# Altium project UMParachuteContr.PrjPCB
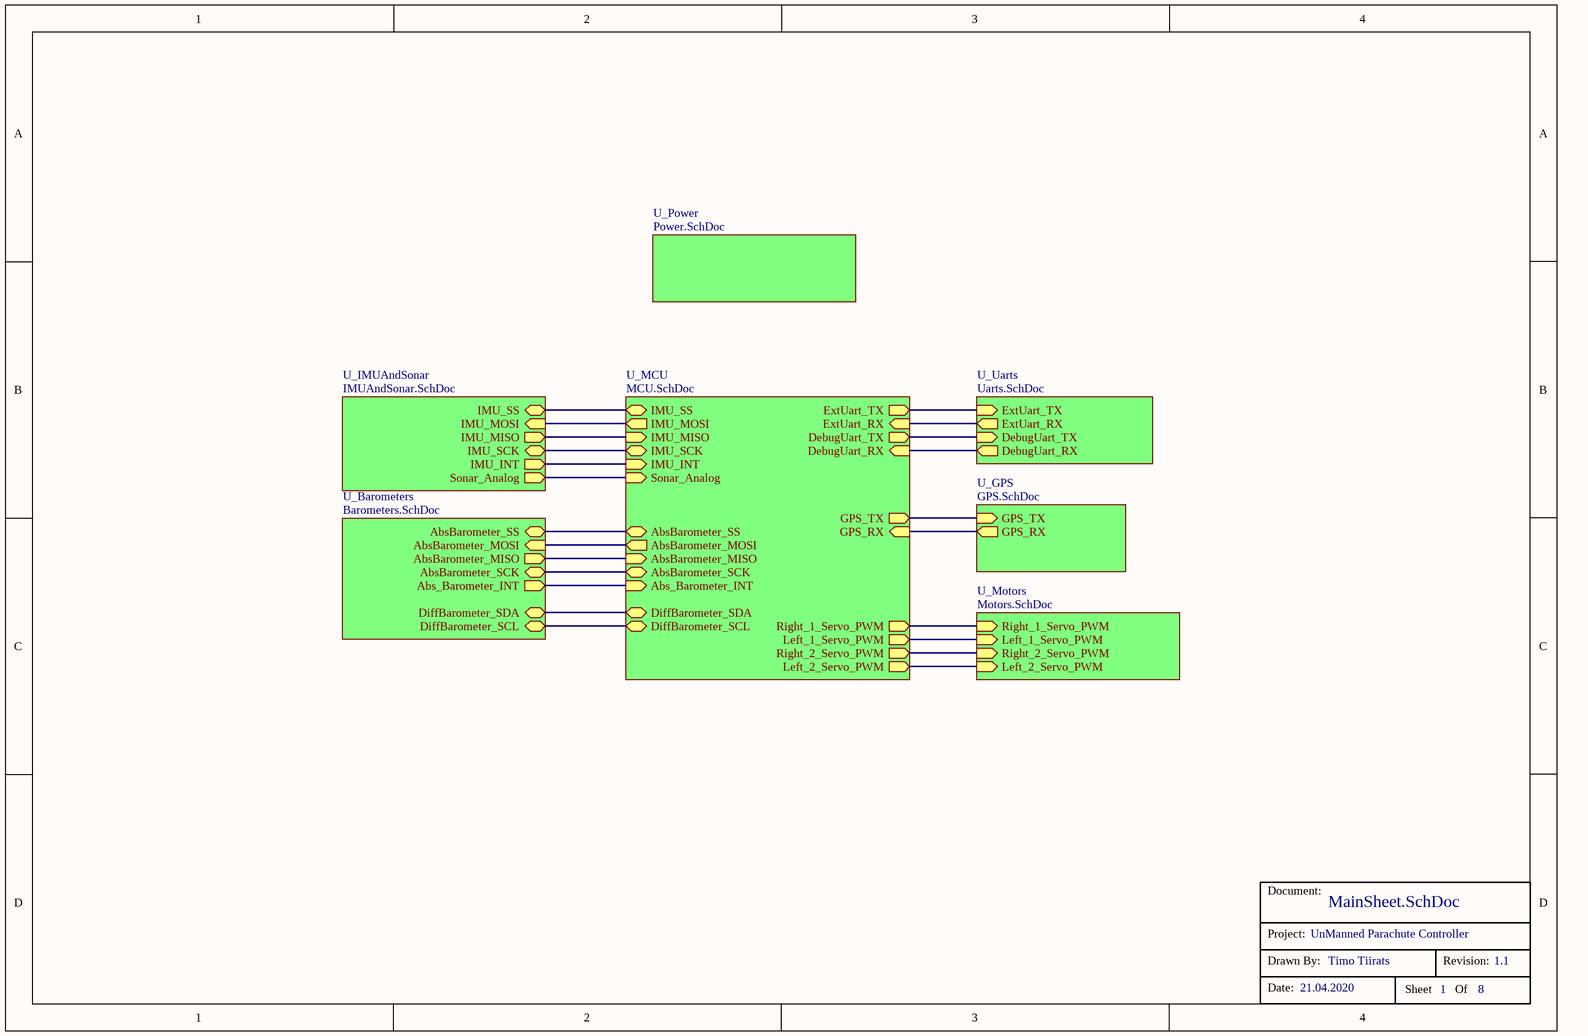
[diagram p0: MainSheet.SchDoc]
RevisionNr: 1.1; Project: UnManned Parachute Controller; Drawn: Timo Tiirats; SaveDate: 21.04.2020
8 sheets, 139 parts. Net scope: hierarchical (ports join the sheet entries above them; power ports are global).
Board file: UMParachuteContr.PcbDoc
Sheets:
  MainSheet.SchDoc
    U_Power = Power.SchDoc
    U_Uarts = Uarts.SchDoc
    U_GPS = GPS.SchDoc
    U_IMUAndSonar = IMUAndSonar.SchDoc
    U_MCU = MCU.SchDoc
    U_Motors = Motors.SchDoc
    U_Barometers = Barometers.SchDoc

## Sheet MainSheet.SchDoc
size A4; SheetNumber: 1; SheetTotal: 8

### Parts
(Parts that share a designator on the sheet are numbered #1, #2 ... from top to bottom, then left to right.)
*#1  TitleBox  (value not drawn)

### Sub-sheets
U_Barometers = Barometers.SchDoc: AbsBarometer_SCK (bidir), AbsBarometer_MOSI (in), AbsBarometer_MISO (out), AbsBarometer_SS (bidir), DiffBarometer_SCL (bidir), DiffBarometer_SDA (bidir), Abs_Barometer_INT (out)
U_GPS = GPS.SchDoc: GPS_TX (in), GPS_RX (out)
U_IMUAndSonar = IMUAndSonar.SchDoc: IMU_SCK (bidir), IMU_MOSI (in), IMU_MISO (out), IMU_SS (bidir), Sonar_Analog (out), IMU_INT (out)
U_MCU = MCU.SchDoc: ExtUart_RX (in), ExtUart_TX (out), IMU_SS (bidir), IMU_MOSI (out), IMU_MISO (in), IMU_SCK (bidir), GPS_RX (in), GPS_TX (out), DiffBarometer_SDA (bidir), DiffBarometer_SCL (bidir), AbsBarometer_SS (bidir), AbsBarometer_MOSI (out), AbsBarometer_MISO (in), AbsBarometer_SCK (bidir), DebugUart_RX (in), DebugUart_TX (out), Sonar_Analog (in), Right_1_Servo_PWM (out), Left_1_Servo_PWM (out), Right_2_Servo_PWM (out), Left_2_Servo_PWM (out), Abs_Barometer_INT (in), IMU_INT (in)
U_Motors = Motors.SchDoc: Right_1_Servo_PWM (in), Left_1_Servo_PWM (in), Right_2_Servo_PWM (in), Left_2_Servo_PWM (in)
U_Power = Power.SchDoc: no entries
U_Uarts = Uarts.SchDoc: DebugUart_RX (out), DebugUart_TX (in), ExtUart_RX (out), ExtUart_TX (in)

### Nets
NetC22_2: sheet U_IMUAndSonar/Sonar_Analog, sheet U_MCU/Sonar_Analog
NetIC2_2: sheet U_MCU/AbsBarometer_SCK, sheet U_Barometers/AbsBarometer_SCK
NetIC2_4: sheet U_MCU/AbsBarometer_MOSI, sheet U_Barometers/AbsBarometer_MOSI
NetIC2_5: sheet U_MCU/AbsBarometer_MISO, sheet U_Barometers/AbsBarometer_MISO
NetIC2_6: sheet U_MCU/AbsBarometer_SS, sheet U_Barometers/AbsBarometer_SS
NetIC2_7: sheet U_MCU/Abs_Barometer_INT, sheet U_Barometers/Abs_Barometer_INT
NetIC3_10: sheet U_MCU/DiffBarometer_SDA, sheet U_Barometers/DiffBarometer_SDA
NetIC3_11: sheet U_MCU/DiffBarometer_SCL, sheet U_Barometers/DiffBarometer_SCL
NetIC4_3: sheet U_MCU/Left_1_Servo_PWM, sheet U_Motors/Left_1_Servo_PWM
NetIC4_4: sheet U_MCU/Right_2_Servo_PWM, sheet U_Motors/Right_2_Servo_PWM
NetIC4_5: sheet U_MCU/Left_2_Servo_PWM, sheet U_Motors/Left_2_Servo_PWM
NetIC4_6: sheet U_MCU/Right_1_Servo_PWM, sheet U_Motors/Right_1_Servo_PWM
NetIC5_11: sheet U_IMUAndSonar/IMU_INT, sheet U_MCU/IMU_INT
NetIC5_12: sheet U_IMUAndSonar/IMU_SCK, sheet U_MCU/IMU_SCK
NetIC5_13: sheet U_IMUAndSonar/IMU_MISO, sheet U_MCU/IMU_MISO
NetIC5_14: sheet U_IMUAndSonar/IMU_MOSI, sheet U_MCU/IMU_MOSI
NetIC5_16: sheet U_IMUAndSonar/IMU_SS, sheet U_MCU/IMU_SS
NetR1_2: sheet U_Uarts/DebugUart_RX, sheet U_MCU/DebugUart_RX
NetR2_2: sheet U_Uarts/DebugUart_TX, sheet U_MCU/DebugUart_TX
NetR3_2: sheet U_Uarts/ExtUart_RX, sheet U_MCU/ExtUart_RX
NetR4_2: sheet U_Uarts/ExtUart_TX, sheet U_MCU/ExtUart_TX
NetR18_2: sheet U_GPS/GPS_TX, sheet U_MCU/GPS_TX
NetR19_2: sheet U_GPS/GPS_RX, sheet U_MCU/GPS_RX

### Notes on the sheet
- Title
- Size:
- Date:
- A4
- Number:
- Time:
- Revision:
- Sheet
- of
- File:
- (in symbol TitleBox) Document:; Project:; Drawn By:; Revision:; Date:; Sheet; Of

## Sheet Power.SchDoc
size A4; SheetNumber: 2; SheetTotal: 8
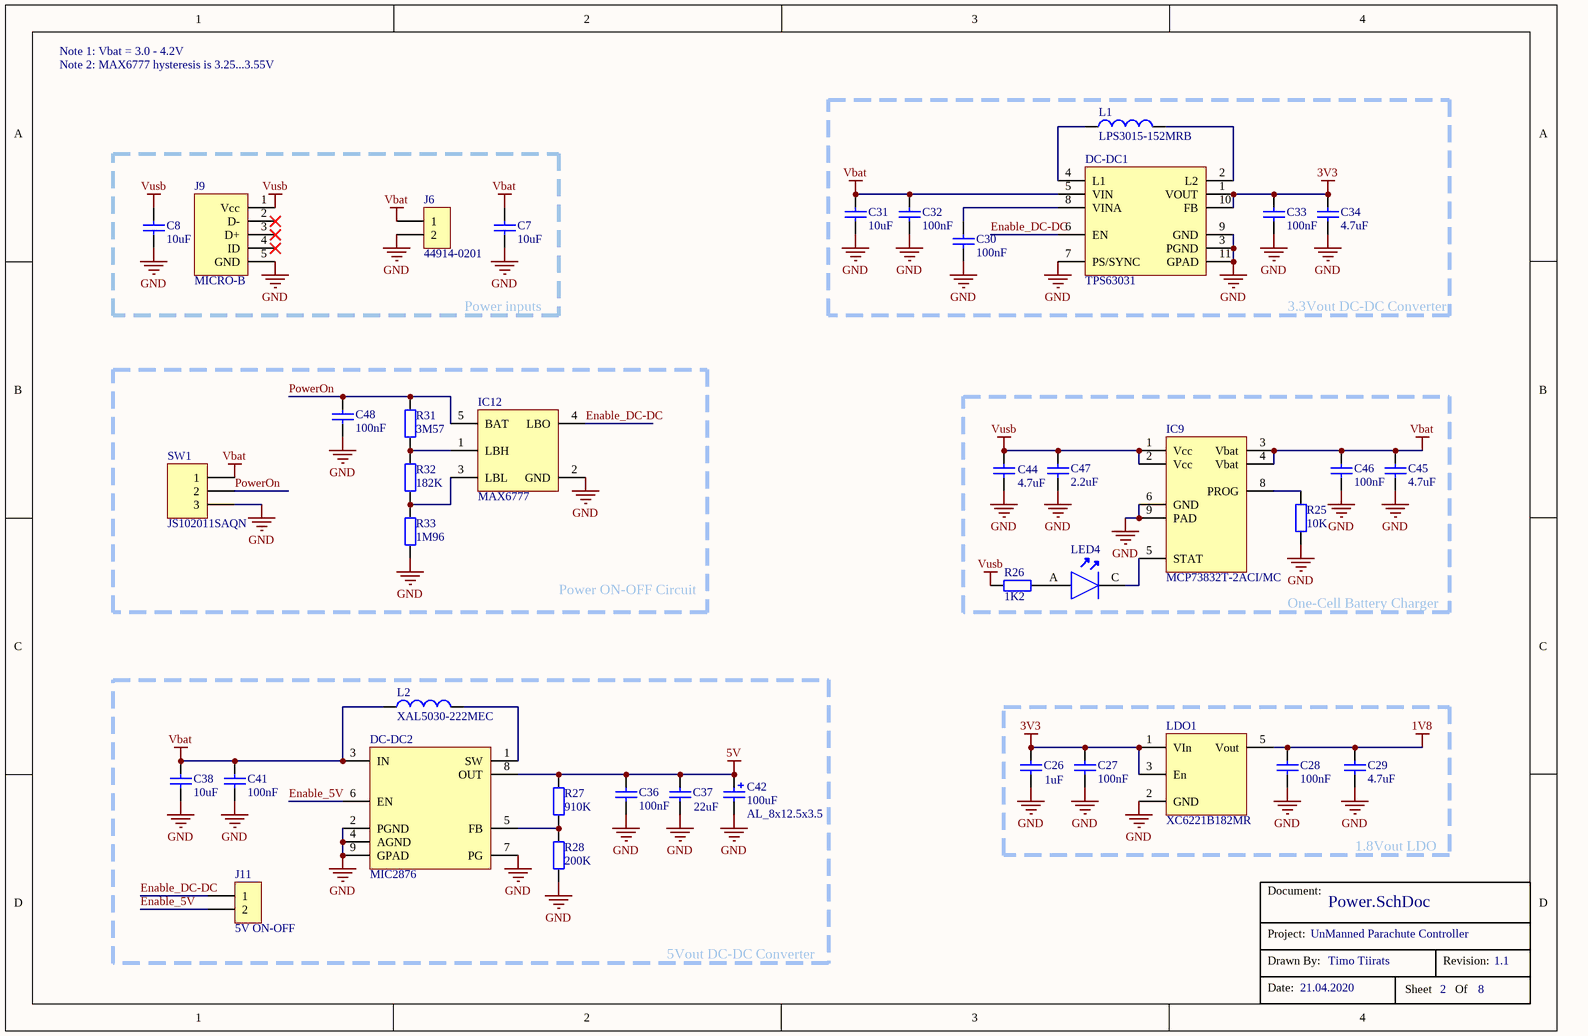
[diagram p1: Power.SchDoc]

### Parts
(Parts that share a designator on the sheet are numbered #1, #2 ... from top to bottom, then left to right.)
*#2  TitleBox  (value not drawn)
C7  Capacitance: 10uF  [C1206 N]
C8  Capacitance: 10uF  [C1206 N]
C26  Capacitance: 1uF  [C0603 N]
C27  Capacitance: 100nF  [C0603 N]
C28  Capacitance: 100nF  [C0603 N]
C29  Capacitance: 4.7uF  [C0603 N]
C30  Capacitance: 100nF  [C0603 N]
C31  Capacitance: 10uF  [C1206 N]
C32  Capacitance: 100nF  [C0603 N]
C33  Capacitance: 100nF  [C0603 N]
C34  Capacitance: 4.7uF  [C0603 N]
C36  Capacitance: 100nF  [C0603 N]
C37  Capacitance: 22uF  [C1206 N]
C38  Capacitance: 10uF  [C1206 N]
C41  Capacitance: 100nF  [C0603 N]
C42  Capacitance: 100uF  [AL_8x12.5x3.5]
C44  Capacitance: 4.7uF  [C1206 N]
C45  Capacitance: 4.7uF  [C1206 N]
C46  Capacitance: 100nF  [C0603 N]
C47  Capacitance: 2.2uF  [C0603 N]
C48  Capacitance: 100nF  [C0603 N]
DC-DC1  TPS63031  [WSON10, 2.6x2.6, LEAST]
DC-DC2  MIC2876  [QFN-8 2x2MM, NOMINAL]
IC9  MCP73832T-2ACI/MC  [DFN-8, 2X3MM]
IC12  MAX6777  [SOT323-5, Nominal]
J6  44914-0201  [44914-0201]
J9  MICRO-B  [MICRO-B]
J11  5V ON-OFF  [Male 1x2 vertical]
L1  LPS3015-152MRB  [LPS3010]
L2  XAL5030-222MEC  [XAL5030-222MEC]
LDO1  XC6221B182MR  [SOT-23-5, Nominal]
LED4  DebugLED1  [0603 NOMINAL]  (value not drawn)
R25  10K  [R0603]
R26  1K2  [R0603]
R27  910K  [R0603]
R28  200K  [R0603]
R31  3M57  [R0603]
R32  182K  [R0603]
R33  1M96  [R0603]
SW1  JS102011SAQN  [JS102011SAQN]

### Blocks framed on the sheet
3.3Vout DC-DC Converter: C30-C34 DC-DC1 L1
Power inputs: C7 C8 J6 J9
Power ON-OFF Circuit: C48 IC12 R31-R33 SW1
One-Cell Battery Charger: C44-C47 IC9 LED4 R25 R26
5Vout DC-DC Converter: C36-C38 C41 C42 DC-DC2 J11 L2 R27 R28
1.8Vout LDO: C26-C29 LDO1

### Nets
1V8: C28.2 C29.2 LDO1.5(Vout)
3V3: C26.2 C27.2 C33.2 C34.2 DC-DC1.1(VOUT) DC-DC1.10(FB) LDO1.1(VIn) LDO1.3(En)
5V: C36.2 C37.2 C42.1 DC-DC2.8(OUT) R27.2
GND: C7.1 C8.1 C26.1 C27.1 C28.1 C29.1 C30.1 C31.1 C32.1 C33.1 C34.1 C36.1 C37.1 C38.1 C41.1 C42.2 C44.1 C45.1 C46.1 C47.1 C48.1 DC-DC1.3(PGND) DC-DC1.7(PS/SYNC) DC-DC1.9(GND) DC-DC1.11(GPAD) DC-DC2.2(PGND) DC-DC2.4(AGND) DC-DC2.7(PG) DC-DC2.9(GPAD) IC9.6(GND) IC9.9(PAD) IC12.2(GND) J6.2 J9.5(GND) LDO1.2(GND) R25.2 R28.1 R33.2 SW1.3
Vbat: C7.2 C31.2 C32.2 C38.2 C41.2 C45.2 C46.2 DC-DC1.5(VIN) DC-DC2.3(IN) IC9.3(Vbat) IC9.4(Vbat) J6.1 L2.1 SW1.1
Vusb: C8.2 C44.2 C47.2 IC9.1(Vcc) IC9.2(Vcc) J9.1(Vcc) R26.1
Enable_5V: DC-DC2.6(EN) J11.2
Enable_DC-DC: DC-DC1.6(EN) IC12.4(LBO) J11.1
PowerOn: C48.2 IC12.5(BAT) R31.1 SW1.2
NetC30_2: C30.2 DC-DC1.8(VINA)
NetDC-DC1_2: DC-DC1.2(L2) L1.2
NetDC-DC1_4: DC-DC1.4(L1) L1.1
NetDC-DC2_1: DC-DC2.1(SW) L2.2
NetDC-DC2_5: DC-DC2.5(FB) R27.1 R28.2
NetIC9_5: IC9.5(STAT) LED4.C
NetIC9_8: IC9.8(PROG) R25.1
NetIC12_1: IC12.1(LBH) R31.2 R32.1
NetIC12_3: IC12.3(LBL) R32.2 R33.1
NetLED4_A: LED4.A R26.2

Not connected (* = marked no-connect by the designer): J9 2(D-)* 3(D+)* 4(ID)*

### Notes on the sheet
- Note 1: Vbat = 3.0 - 4.2V
- Note 2: MAX6777 hysteresis is 3.25...3.55V
- (in symbol TitleBox) Document:; Project:; Drawn By:; Revision:; Date:; Sheet; Of

### Library data of the parts
C7 C8 C26-C34 C36-C38 C41 C44-C48 = Capacitor: Ceramic capacitor; Type: MLCC; Voltage rating: *V; Characteristic: *; Manufacturer: *
  C7 C8 C31 C37 C38 C44 C45: Note: C1206 N
  C26-C30 C32-C34 C36 C41 C46-C48: Note: C0603 N
C42 = Capacitor Polarized: Polarized Capacitor; Voltage rating: *V; ESR: *R; Temp MAX: *C; Temp MIN: *C; Manufacturer: *; Note: AL_8x12.5x3.5
DC-DC1 = TPS63031: DC-DC CONVERTER, 3.3Vout, 1.8...5.5Vin, buck-boost, 800mA, TPS63031, TEXAS INSTRUMENTS; ComponentLink1Description: Datasheet; ComponentLink1URL: http://www.ti.com/lit/ds/symlink/tps63030.pdf
DC-DC2 = MIC2876: DC-DC CONVERTER, ADJ, Vin...5.5Vout, 2.5...5.5Vin, 4.8A, boost, MIC2875, Microchip; ComponentLink1Description: Datasheet; ComponentLink1URL: http://ww1.microchip.com/downloads/en/DeviceDoc/20005549A.pdf
IC9 = MCP73832T-2ACI: Battery Charger, 1 Cell of Li-Ion, Li-Pol, 3.75...6Vin, 15...500mA, 4.2Vout, DFN-8, MCP73832T-2ACI/MC, MICROCHIP; Output Current: 505mA; Output Voltage: 4.2V; Supply Voltage Range: 3.75 .. 6V; Operating Supply Current: 510uA; Supplier 1: Farnell; Manufacturer: Microchip; Manufacturer Part Number: MCP73832T-2ACI/MC; Operating Temperature Range: -40 .. 85°C; ComponentLink1URL: http://www.microchip.com/mymicrochip/filehandler.aspx?ddocname=en026002&src-supplier=Digi-Key; ComponentLink1Description: Datasheet; Supplier 2: Mouser; Supplier Part Number 1: 2857755RL; Supplier Part Number 2: 579-MCP73832T-2ACIMC
IC12 = MAX6777: Battery monitor, 1 cell, Li-ion, adj hysteresis, 1.0...5.5Vin, MAX6777, Maxim; ComponentLink1Description: Datasheet; ComponentLink1URL: http://www.farnell.com/datasheets/702614.pdf?_ga=2.184496931.465896120.1585759027-1429076973.1585049483
J6 = 44914-0201: MicroFit 2-pin CPI Header, 2 Row, Vertical; Manufacturer: Molex; Number of Positions: 2; Current Rating: 5A; Voltage Rating: 250V; Pitch: 3mm; Glow Wire Compliant: Compliant; Supplier 1: Mouser; Manufacturer Part Number: 44914-0201; Stock 1: 1889; Mount: Through Hole; Contact Plating: Tin; Color: Black; Housing Material: Thermoplastic; Operating Temperature: -40...105°C; Package Quantity: 3168; Number of Rows: 2; Packaging: Tray; Termination: Solder; Number of Contacts: 2; Orientation: Vertical; Voltage Rating (DC): 250V; Number of Circuits: 2; Row Spacing: 3mm; REACH SVHC: No SVHC; Halogen Free: Low Halogen; Flammability Rating: UL94 V-0; ComponentLink1URL: http://www.mouser.com/ds/2/276/0449140201_PCB_HEADERS-146076.pdf?src-supplier=Mouser; ComponentLink1Description: http://www.mouser.com/ds/2/276/0449140201_PCB_HEADERS-146076.pdf?src-supplier=Mouser; ComponentLink2URL: http://www.onlinecomponents.com/productFiles/mf-MOL/0449140201_pcb_headers.pdf?src-supplier=Onlinecomponents.com; ComponentLink2Description: http://www.onlinecomponents.com/productFiles/mf-MOL/0449140201_pcb_headers.pdf?src-supplier=Onlinecomponents.com; Supplier Part Number 1: 538-44914-0201
J9 = MICRO-B: Micro USB 2.0 type B, receptacle; Manufacturer: Molex; Manufacturer Part Number: 47346-1001; Pitch: 0.65mm; Supplier 1: Farnell; Operating Temperature Range: -30 .. 85°C; Orientation: Right Angle; Supplier 2: Mouser; Supplier Part Number 2: 538-47346-1001; Supplier Part Number 1: 2779944; ComponentLink1Description: Datasheet; ComponentLink1URL: http://www.farnell.com/datasheets/2696879.pdf
J11 = header 1x2 vertical
L1 = LPS3015-152MRB: Inductor, 1.5uH, 100mR, 1.3A, LPS3015-152MRB, COILCRAFT; ComponentLink1Description: Datasheet; ComponentLink1URL: http://www.farnell.com/datasheets/1805321.pdf?_ga=2.252438669.562777961.1586113222-1429076973.1585049483
L2 = XAL5030-222MEC: Inductor, 2.2uH, 14mR, 9.2A, Coilcraft, XAL5030-222MEC; ComponentLink1Description: Datasheet; ComponentLink1URL: http://www.farnell.com/datasheets/1681990.pdf?_ga=2.217580054.1886183070.1585497363-1429076973.1585049483
LDO1 = XC6221B182MR: LDO, 1.8Vout, 1.6-6Vin, SOT-25, SMD,  HIGH SPEED LOW NOISE, TOREX - XC6221B182MR; Input Voltage Max: 6V; Fixed Output Voltage Nom.: 1.8V; Dropout Voltage Vdo: 0.125V @ 100mA; Accuracy %: 2%; Output Current Max: 200mA; Supplier 1: Farnell; Manufacturer: TOREX; Manufacturer Part Number: XC6221B182MR; LDO Regulator Case Style: SOT-25; Operating Temperature Range: -40°C to +85; Supplier 2: Digi-Key; Current - Output: 200mA; ComponentLink2URL: http://www.torex.co.jp/english/products/voltage_regulators/data/XC6221.pdf; ComponentLink2Description: Datasheet; Supplier Part Number 1: 1454268; Supplier Part Number 2: 893-1096-6-ND
LED4 = Generic LED: SMD mono-color Chip LED; Color: Green
R25-R28 R31-R33 = Resistor: Precision: *%; Voltage rating: *V; Temp coefficient: *ppm; Power rating: *mW; Manufacturer: *; Note: R0603
  R25: Resistance: 10K
  R26: Resistance: 1K2
  R27: Resistance: 910K
  R28: Resistance: 200K
  R31: Resistance: 3M57
  R32: Resistance: 182K
  R33: Resistance: 1M96
SW1 = JS102011SAQN: Manufacturer: ITT C&K; Max Voltage Rating (DC): 6V; Current Rating: 300mA; Contact Resistance: 70mR; Electrical Life: 5000Cycles; Switch Function: On-On; Supplier 1: Farnell; Manufacturer Part Number: JS102011SAQN; Mount: Surface Mount; Operating Temperature Range: -40 .. 85°C; Voltage Rating (DC): 6V; Contact Current Rating: 300mA; Orientation: Right Angle; ComponentLink1URL: http://www.farnell.com/datasheets/2044601.pdf?src-supplier=Element14; ComponentLink1Description: Datasheet; ComponentLink2URL: http://www1.futureelectronics.com/doc/C%20-%20K%20COMPONENTS/JS102011SAQN.pdf?src-supplier=Future+Electronics; ComponentLink2Description: http://www1.futureelectronics.com/doc/C%20-%20K%20COMPONENTS/JS102011SAQN.pdf?src-supplier=Future+Electronics; ComponentLink3URL: https://www.verical.com/server-webapp/html/getDatasheet?partID=313004&src-supplier=Verical; ComponentLink3Description: https://www.verical.com/server-webapp/html/getDatasheet?partID=313004&src-supplier=Verical; ComponentLink4URL: https://www.ckswitches.com/media/1422/js.pdf?src-supplier=Digi-Key; ComponentLink4Description: https://www.ckswitches.com/media/1422/js.pdf?src-supplier=Digi-Key; ComponentLink5URL: http://www.ck-components.com/14398/js_1nov12.pdf/?src-supplier=Avnet; ComponentLink5Description: http://www.ck-components.com/14398/js_1nov12.pdf/?src-supplier=Avnet; ComponentLink6URL: http://www.ck-components.com/14398/js_1nov12.pdf/?src-supplier=Avnet+Europe; ComponentLink6Description: http://www.ck-components.com/14398/js_1nov12.pdf/?src-supplier=Avnet+Europe; ComponentLink7URL: http://www.mouser.com/ds/2/60/JS_7jan16-221285.pdf?src-supplier=Mouser; ComponentLink7Description: http://www.mouser.com/ds/2/60/JS_7jan16-221285.pdf?src-supplier=Mouser; Supplier Part Number 1: 2320017RL; Supplier Prt Number 1: 2320017

## Sheet Uarts.SchDoc
size A4; SheetNumber: 4; SheetTotal: 8
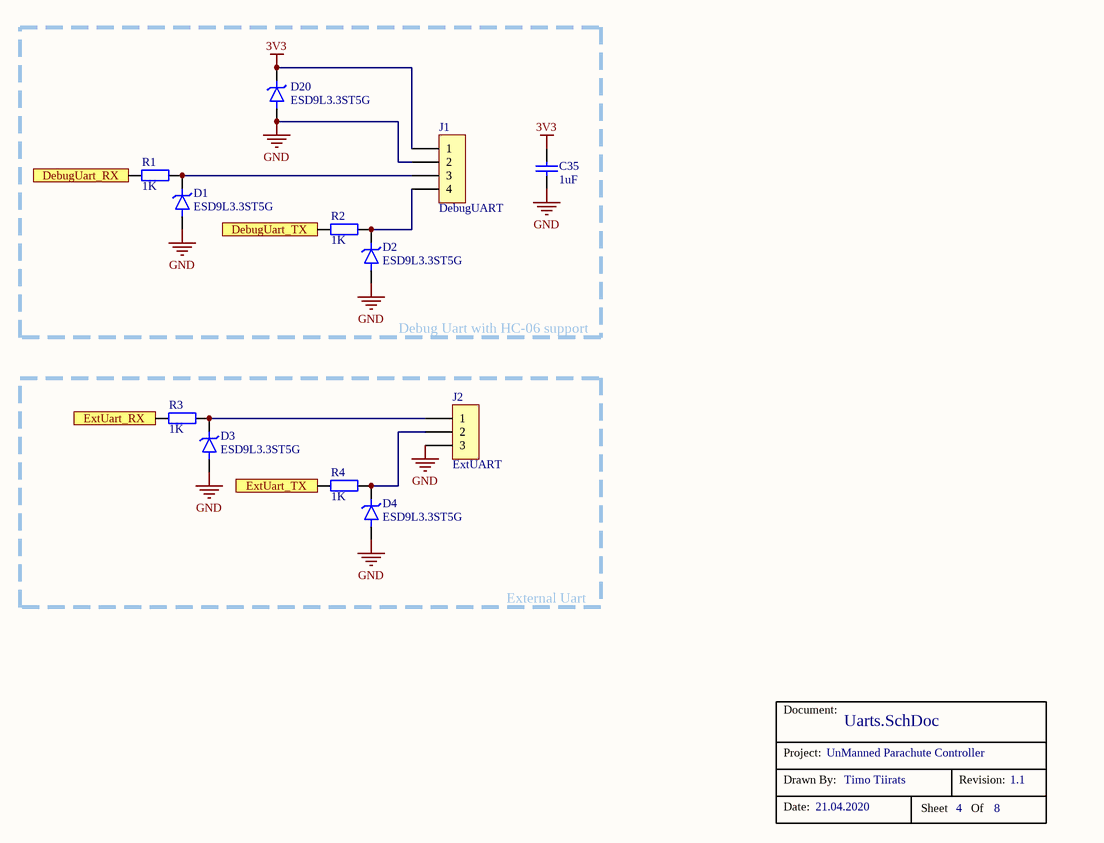
[diagram p2: Uarts.SchDoc]

### Parts
(Parts that share a designator on the sheet are numbered #1, #2 ... from top to bottom, then left to right.)
*#3  TitleBox  (value not drawn)
C35  Capacitance: 1uF  [C0603 N]
D1  ESD9L3.3ST5G  [SOD923F, NOMINAL]
D2  ESD9L3.3ST5G  [SOD923F, NOMINAL]
D3  ESD9L3.3ST5G  [SOD923F, NOMINAL]
D4  ESD9L3.3ST5G  [SOD923F, NOMINAL]
D20  ESD9L3.3ST5G  [SOD923F, NOMINAL]
J1  DebugUART  [female 1x4 vertical]
J2  ExtUART  [UART_HEADER]
R1  1K  [R0603]
R2  1K  [R0603]
R3  1K  [R0603]
R4  1K  [R0603]

### Blocks framed on the sheet
Debug Uart with HC-06 support: C35 D1 D2 D20 J1 R1 R2
External Uart: D3 D4 J2 R3 R4

### Ports
DebugUart_RX (out), DebugUart_TX (in), ExtUart_RX (out), ExtUart_TX (in)

### Nets
3V3: C35.2 D20.C J1.1
GND: C35.1 D1.A D2.A D3.A D4.A D20.A J1.2 J2.3
NetD1_C: D1.C J1.3 R1.1
NetD2_C: D2.C J1.4 R2.1
NetD3_C: D3.C J2.1 R3.1
NetD4_C: D4.C J2.2 R4.1
NetR1_2: R1.2 ; port DebugUart_RX
NetR2_2: R2.2 ; port DebugUart_TX
NetR3_2: R3.2 ; port ExtUart_RX
NetR4_2: R4.2 ; port ExtUart_TX

### Notes on the sheet
- (in symbol TitleBox) Document:; Project:; Drawn By:; Revision:; Date:; Sheet; Of

### Library data of the parts
C35 = Capacitor: as C7 on sheet Power; Characteristic: *; Manufacturer: *; Note: C0603 N
D1-D4 D20 = ESD9L3.3ST5G: TVS DIODE, Unidir, 3.3V/9V, 150mW, SOD-923, ESD9L3.3ST5G, ON SEMICONDUCTOR; Clamping Voltage: 9V; Reverse Standoff Voltage: 3.3V; Breakdown Voltage: 4.8V; Peak Pulse Current: 1A; Leakage Current: 1uA; Supplier 1: Farnell; Manufacturer: ON Semiconductor; Manufacturer Part Number: ESD9L3.3ST5G; Case/Package: SOD-923-2; Operating Temperature Range: -55 .. 125°C; Peak Pulse Power: 150mW; ComponentLink1URL: https://www.verical.com/server-webapp/html/getDatasheet?partID=148186&src-supplier=Verical; ComponentLink1Description: Datasheet; Supplier Part Number 1: 2533269
J1 = header 1x4 vertical
J2 = header 1x3 vertical
R1-R4 = Resistor: as R25 on sheet Power; Manufacturer: *; Resistance: 1K; Note: R0603

## Sheet GPS.SchDoc
size A4; SheetNumber: 6; SheetTotal: 8
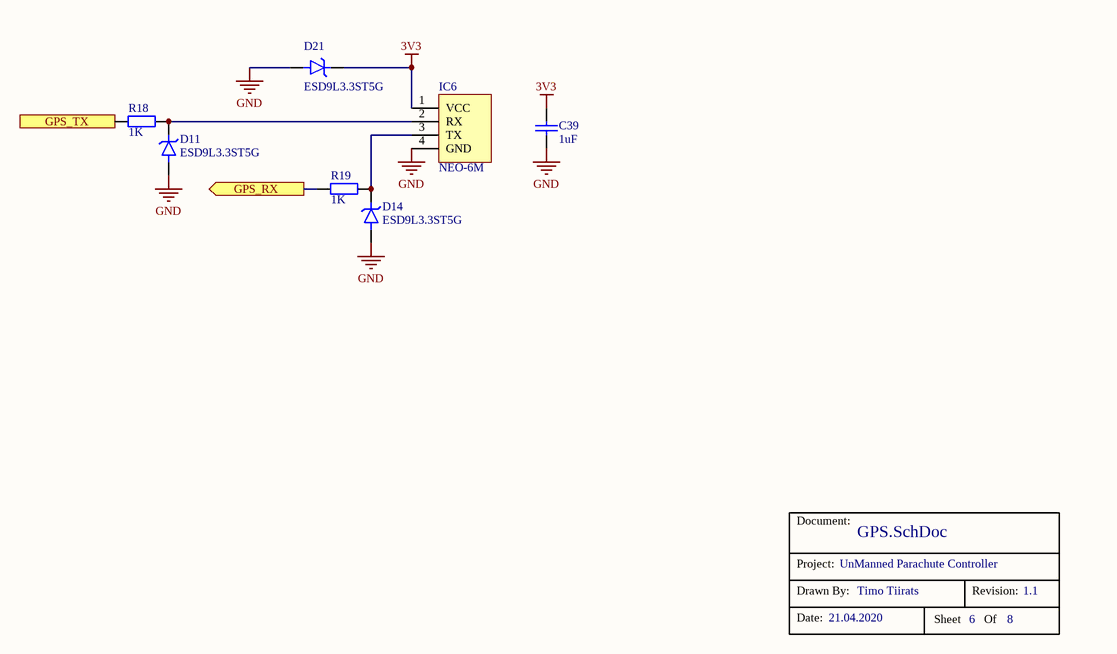
[diagram p3: GPS.SchDoc]

### Parts
(Parts that share a designator on the sheet are numbered #1, #2 ... from top to bottom, then left to right.)
*#4  TitleBox  (value not drawn)
C39  Capacitance: 1uF  [C0603 N]
D11  ESD9L3.3ST5G  [SOD923F, NOMINAL]
D14  ESD9L3.3ST5G  [SOD923F, NOMINAL]
D21  ESD9L3.3ST5G  [SOD923F, NOMINAL]
IC6  NEO-6M  [NEO-6M Module]
R18  1K  [R0603]
R19  1K  [R0603]

### Ports
GPS_RX (out), GPS_TX (in)

### Nets
3V3: C39.2 D21.C IC6.1(VCC)
GND: C39.1 D11.A D14.A D21.A IC6.4(GND)
NetD11_C: D11.C IC6.2(RX) R18.1
NetD14_C: D14.C IC6.3(TX) R19.1
NetR18_2: R18.2 ; port GPS_TX
NetR19_2: R19.2 ; port GPS_RX

### Notes on the sheet
- (in symbol TitleBox) Document:; Project:; Drawn By:; Revision:; Date:; Sheet; Of

### Library data of the parts
C39 = Capacitor: as C7 on sheet Power; Characteristic: *; Manufacturer: *; Note: C0603 N
D11 D14 D21 = ESD9L3.3ST5G: as D1 on sheet Uarts; Supplier 1: Farnell; Manufacturer: ON Semiconductor; Manufacturer Part Number: ESD9L3.3ST5G; Case/Package: SOD-923-2; Operating Temperature Range: -55 .. 125°C; Peak Pulse Power: 150mW; ComponentLink1URL: https://www.verical.com/server-webapp/html/getDatasheet?partID=148186&src-supplier=Verical; ComponentLink1Description: Datasheet; Supplier Part Number 1: 2533269
IC6 = NEO-6M: GPS GLONASS module with antenna, +-2m, -162dBm, 3 .. 5Vin; ComponentLink1Description: Datasheet; ComponentLink1URL: https://www.u-blox.com/sites/default/files/products/documents/NEO-6_DataSheet_(GPS.G6-HW-09005).pdf
R18 R19 = Resistor: as R25 on sheet Power; Manufacturer: *; Resistance: 1K; Note: R0603

## Sheet IMUAndSonar.SchDoc
size A4; SheetNumber: 7; SheetTotal: 8
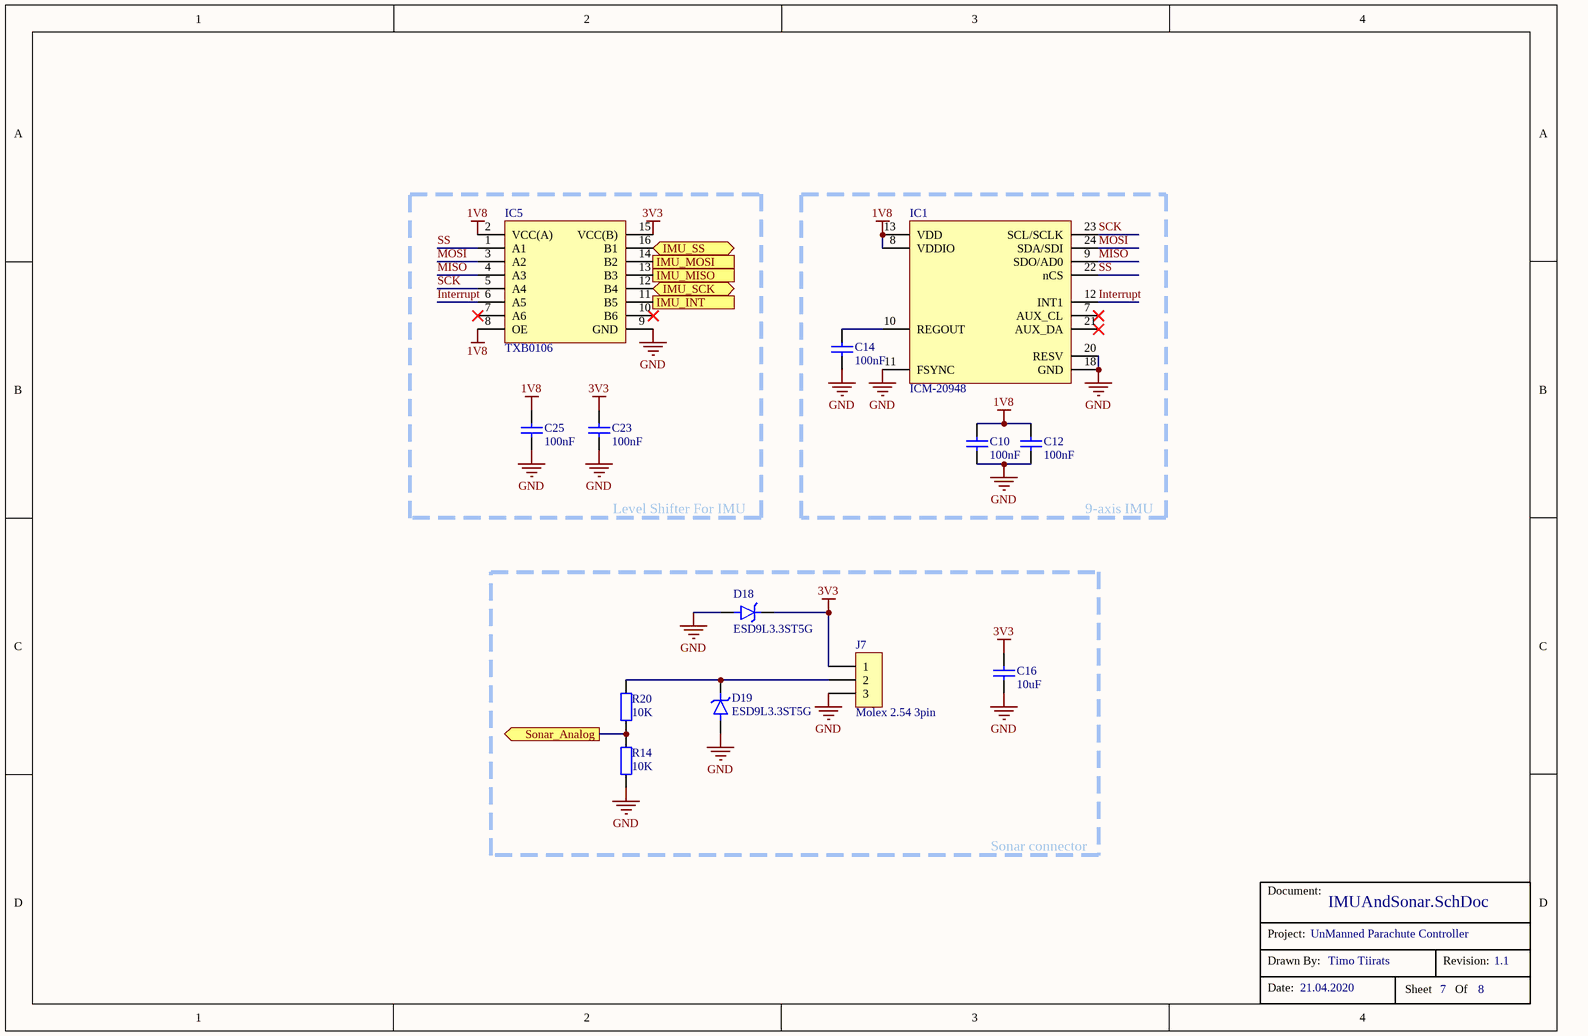
[diagram p4: IMUAndSonar.SchDoc]

### Parts
(Parts that share a designator on the sheet are numbered #1, #2 ... from top to bottom, then left to right.)
*#5  TitleBox  (value not drawn)
C10  Capacitance: 100nF  [C0603 N]
C12  Capacitance: 100nF  [C0603 N]
C14  Capacitance: 100nF  [C0603 N]
C16  Capacitance: 10uF  [C1206 N]
C23  Capacitance: 100nF  [C0603 N]
C25  Capacitance: 100nF  [C0603 N]
D18  ESD9L3.3ST5G  [SOD923F, NOMINAL]
D19  ESD9L3.3ST5G  [SOD923F, NOMINAL]
IC1  ICM-20948  [QFN-24, 3x3MM, NOMINAL]
IC5  TXB0106  [VQFN-16, 4x3.5MM, NOMINAL]
J7  Molex 2.54 3pin  [22-27-2031]
R14  10K  [R0603]
R20  10K  [R0603]

### Blocks framed on the sheet
Level Shifter For IMU: C23 C25 IC5
9-axis IMU: C10 C12 C14 IC1
Sonar connector: C16 D18 D19 J7 R14 R20

### Ports
IMU_INT (out), IMU_MISO (out), IMU_MOSI (in), IMU_SCK (bidir), IMU_SS (bidir), Sonar_Analog (out)

### Nets
1V8: C10.2 C12.2 C25.2 IC1.8(VDDIO) IC1.13(VDD) IC5.2(VCC(A)) IC5.8(OE)
3V3: C16.2 C23.2 D18.C IC5.15(VCC(B)) J7.1
GND: C10.1 C12.1 C14.1 C16.1 C23.1 C25.1 D18.A D19.A IC1.11(FSYNC) IC1.18(GND) IC1.20(RESV) IC5.9(GND) J7.3 R14.2
Interrupt: IC1.12(INT1) IC5.6(A5)
MISO: IC1.9(SDO/AD0) IC5.4(A3)
MOSI: IC1.24(SDA/SDI) IC5.3(A2)
SCK: IC1.23(SCL/SCLK) IC5.5(A4)
SS: IC1.22(nCS) IC5.1(A1)
NetC14_2: C14.2 IC1.10(REGOUT)
NetC22_2: R14.1 R20.2 ; port Sonar_Analog
NetD19_C: D19.C J7.2 R20.1
NetIC5_11: IC5.11(B5) ; port IMU_INT
NetIC5_12: IC5.12(B4) ; port IMU_SCK
NetIC5_13: IC5.13(B3) ; port IMU_MISO
NetIC5_14: IC5.14(B2) ; port IMU_MOSI
NetIC5_16: IC5.16(B1) ; port IMU_SS

Not connected (* = marked no-connect by the designer): IC1 7(AUX_CL)* 21(AUX_DA)*; IC5 7(A6)* 10(B6)*

### Notes on the sheet
- (in symbol TitleBox) Document:; Project:; Drawn By:; Revision:; Date:; Sheet; Of

### Library data of the parts
C10 C12 C14 C16 C23 C25 = Capacitor: as C7 on sheet Power; Characteristic: *; Manufacturer: *
  C10 C12 C14 C23 C25: Note: C0603 N
  C16: Note: C1206 N
D18 D19 = ESD9L3.3ST5G: as D1 on sheet Uarts; Supplier 1: Farnell; Manufacturer: ON Semiconductor; Manufacturer Part Number: ESD9L3.3ST5G; Case/Package: SOD-923-2; Operating Temperature Range: -55 .. 125°C; Peak Pulse Power: 150mW; ComponentLink1URL: https://www.verical.com/server-webapp/html/getDatasheet?partID=148186&src-supplier=Verical; ComponentLink1Description: Datasheet; Supplier Part Number 1: 2533269
IC1 = ICM-20948: 9-axis IMU, SPI and I2C, 1.8Vin, 24QFN; ComponentLink1Description: Datasheet; ComponentLink1URL: https://www.invensense.com/wp-content/uploads/2016/06/DS-000189-ICM-20948-v1.3.pdf; Supplier 1: Farnell; Supplier Part Number 1: 2911498
IC5 = TXB0106: Level shifter, 6 inputs, 1.2 .. 5.5Vin, 4ns delay, TXB0106, TEXAS INSTRUMENTS; ComponentLink1Description: Datasheet; ComponentLink1URL: http://www.ti.com/lit/ds/symlink/txb0106.pdf; Supplier 1: Farnell; Supplier Part Number 1: 3120970
J7 = Molex header, 3 pin, KK 6410 series: Current Rating: 4A; Supplier 1: Farnell; Manufacturer Part Number: 22-27-2031; Product Range: KK 6410 Series; ComponentLink1URL: http://www.farnell.com/datasheets/1023435.pdf; ComponentLink1Description: Datasheet; ComponentLink2URL: http://www.farnell.com/cad/1595526.pdf; ComponentLink2Description: Drawing; Supplier 2: Mouser; Supplier 3: TME; Supplier Part Number 1: 9731156; Supplier Part Number 2: 538-22-27-2031; Supplier Part Number 3: MX-6410-03A
R14 R20 = Resistor: as R25 on sheet Power; Manufacturer: *; Resistance: 10K; Note: R0603

## Sheet MCU.SchDoc
size A4; SheetNumber: 3; SheetTotal: 8
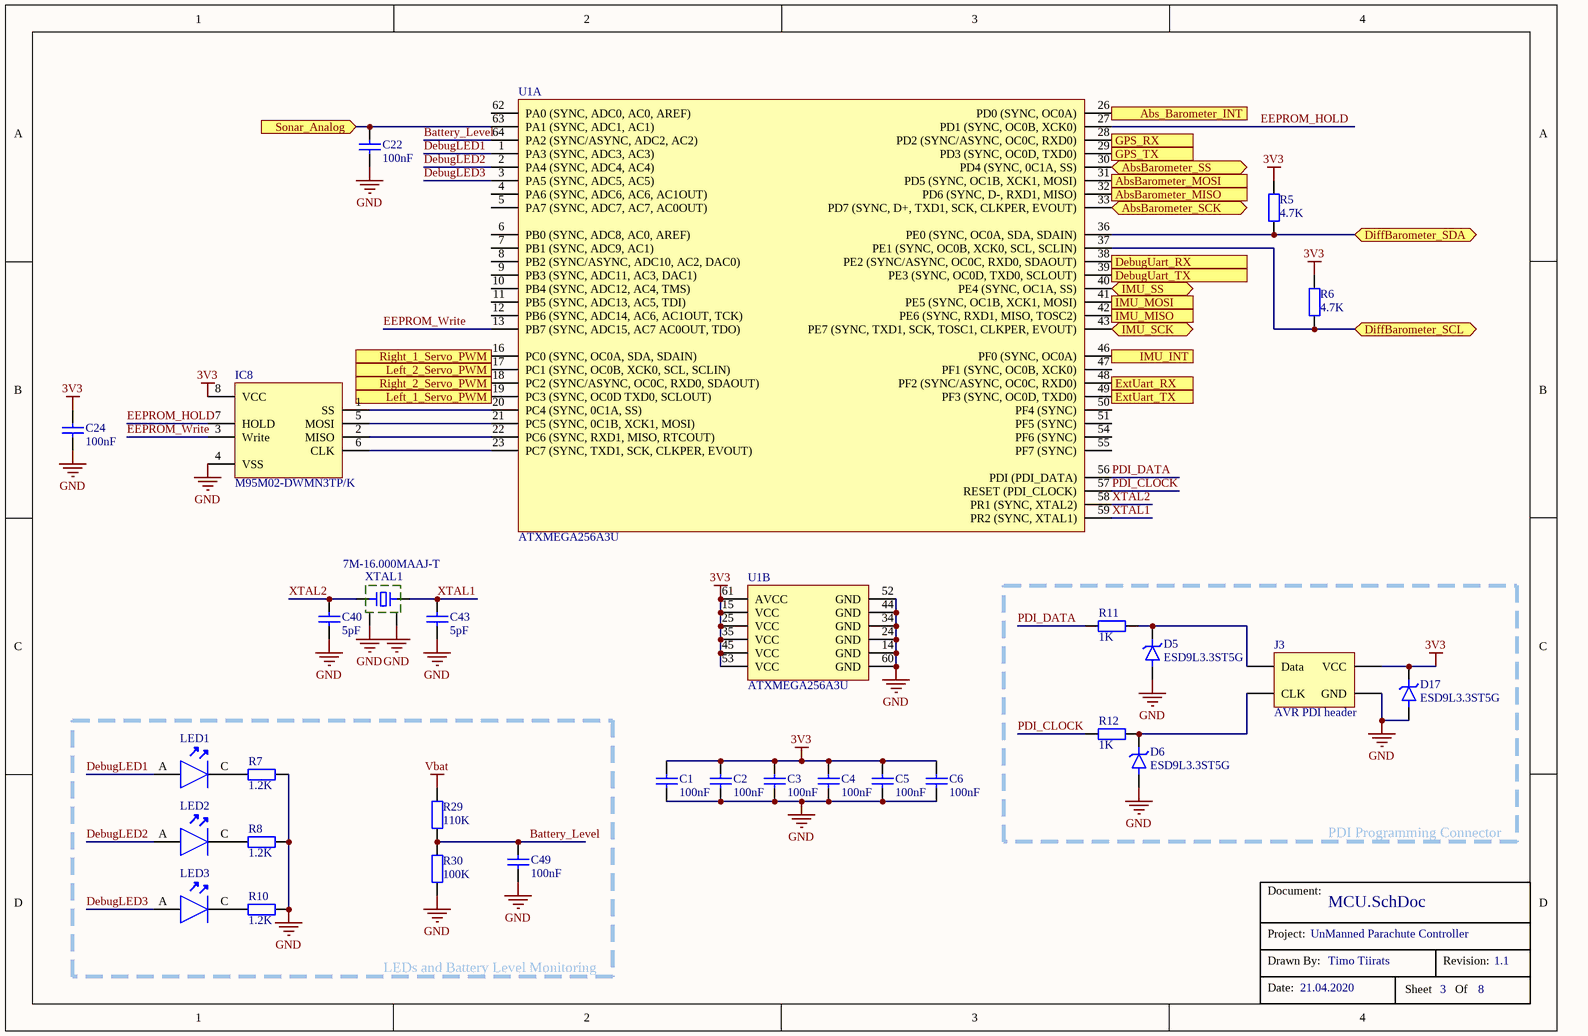
[diagram p5: MCU.SchDoc]

### Parts
(Parts that share a designator on the sheet are numbered #1, #2 ... from top to bottom, then left to right.)
*#6  TitleBox  (value not drawn)
C1  Capacitance: 100nF  [C0603 N]
C2  Capacitance: 100nF  [C0603 N]
C3  Capacitance: 100nF  [C0603 N]
C4  Capacitance: 100nF  [C0603 N]
C5  Capacitance: 100nF  [C0603 N]
C6  Capacitance: 100nF  [C0603 N]
C22  Capacitance: 100nF  [C0603 N]
C24  Capacitance: 100nF  [C0603 N]
C40  Capacitance: 5pF  [C0603 N]
C43  Capacitance: 5pF  [C0603 N]
C49  Capacitance: 100nF  [C0603 N]
D5  ESD9L3.3ST5G  [SOD923F, NOMINAL]
D6  ESD9L3.3ST5G  [SOD923F, NOMINAL]
D17  ESD9L3.3ST5G  [SOD923F, NOMINAL]
IC8  M95M02-DWMN3TP/K  [SOIC8, JEDEC MS-012-AA, Nominal]
J3  AVR PDI header  [Male 2x3 vertical]
LED1  DebugLED1  [0603 NOMINAL]  (value not drawn)
LED2  DebugLED2  [0603 NOMINAL]  (value not drawn)
LED3  DebugLED3  [0603 NOMINAL]  (value not drawn)
R5  4.7K  [R0603]
R6  4.7K  [R0603]
R7  1.2K  [R0603]
R8  1.2K  [R0603]
R10  1.2K  [R0603]
R11  1K  [R0603]
R12  1K  [R0603]
R29  110K  [R0603]
R30  100K  [R0603]
U1  ATXMEGA256A3U  [TQFP-64, NOMINAL]  (parts A,B of 2)
XTAL1  7M-16.000MAAJ-T  [7M 3.2x2.5mm]

### Blocks framed on the sheet
PDI Programming Connector: D5 D6 D17 J3 R11 R12
LEDs and Battery Level Monitoring: C49 LED1-LED3 R7 R8 R10 R29 R30

### Ports
Abs_Barometer_INT (in), AbsBarometer_MISO (in), AbsBarometer_MOSI (out), AbsBarometer_SCK (bidir), AbsBarometer_SS (bidir), DebugUart_RX (in), DebugUart_TX (out), DiffBarometer_SCL (bidir), DiffBarometer_SDA (bidir), ExtUart_RX (in), ExtUart_TX (out), GPS_RX (in), GPS_TX (out), IMU_INT (in), IMU_MISO (in), IMU_MOSI (out), IMU_SCK (bidir), IMU_SS (bidir), Left_1_Servo_PWM (out), Left_2_Servo_PWM (out), Right_1_Servo_PWM (out), Right_2_Servo_PWM (out), Sonar_Analog (in)

### Nets
3V3: C1.2 C2.2 C3.2 C4.2 C5.2 C6.2 C24.2 D17.C IC8.8(VCC) J3.2(VCC) R5.2 R6.2 U1.15(VCC) U1.25(VCC) U1.35(VCC) U1.45(VCC) U1.53(VCC) U1.61(AVCC)
GND: C1.1 C2.1 C3.1 C4.1 C5.1 C6.1 C22.1 C24.1 C40.1 C43.1 C49.1 D5.A D6.A D17.A IC8.4(VSS) J3.6(GND) R7.1 R8.1 R10.1 R30.2 U1.14(GND) U1.24(GND) U1.34(GND) U1.44(GND) U1.52(GND) U1.60(GND) XTAL1.2(gnd) XTAL1.4(gnd1)
Vbat: R29.1
Battery_Level: C49.2 R29.2 R30.1 U1.64(PA2_(SYNC/ASYNC,_ADC2,_AC2))
DebugLED1: LED1.A U1.1(PA3_(SYNC,_ADC3,_AC3))
DebugLED2: LED2.A U1.2(PA4_(SYNC,_ADC4,_AC4))
DebugLED3: LED3.A U1.3(PA5_(SYNC,_ADC5,_AC5))
EEPROM_HOLD: IC8.7(HOLD) U1.27(PD1_(SYNC,_OC0B,_XCK0))
EEPROM_Write: IC8.3(Write) U1.13(PB7_(SYNC,_ADC15,_AC7_AC0OUT,_TDO))
PDI_CLOCK: R12.2 U1.57(RESET_(PDI_CLOCK))
PDI_DATA: R11.2 U1.56(PDI_(PDI_DATA))
XTAL1: C43.2 U1.59(PR2_(SYNC,_XTAL1)) XTAL1.3(X2)
XTAL2: C40.2 U1.58(PR1_(SYNC,_XTAL2)) XTAL1.1(X1)
NetC22_2: C22.2 U1.63(PA1_(SYNC,_ADC1,_AC1)) ; port Sonar_Analog
NetD5_C: D5.C J3.1(Data) R11.1
NetD6_C: D6.C J3.5(CLK) R12.1
NetIC2_2: U1.33(PD7_(SYNC,_D+,_TXD1,_SCK,_CLKPER,_EVOUT)) ; port AbsBarometer_SCK
NetIC2_4: U1.31(PD5_(SYNC,_OC1B,_XCK1,_MOSI)) ; port AbsBarometer_MOSI
NetIC2_5: U1.32(PD6_(SYNC,_D-,_RXD1,_MISO)) ; port AbsBarometer_MISO
NetIC2_6: U1.30(PD4_(SYNC,_0C1A,_SS)) ; port AbsBarometer_SS
NetIC2_7: U1.26(PD0_(SYNC,_OC0A)) ; port Abs_Barometer_INT
NetIC3_10: R5.1 U1.36(PE0_(SYNC,_OC0A,_SDA,_SDAIN)) ; port DiffBarometer_SDA
NetIC3_11: R6.1 U1.37(PE1_(SYNC,_OC0B,_XCK0,_SCL,_SCLIN)) ; port DiffBarometer_SCL
NetIC4_3: U1.19(PC3_(SYNC,_OC0D_TXD0,_SCLOUT)) ; port Left_1_Servo_PWM
NetIC4_4: U1.18(PC2_(SYNC/ASYNC,_OC0C,_RXD0,_SDAOUT)) ; port Right_2_Servo_PWM
NetIC4_5: U1.17(PC1_(SYNC,_OC0B,_XCK0,_SCL,_SCLIN)) ; port Left_2_Servo_PWM
NetIC4_6: U1.16(PC0_(SYNC,_OC0A,_SDA,_SDAIN)) ; port Right_1_Servo_PWM
NetIC5_11: U1.46(PF0_(SYNC,_OC0A)) ; port IMU_INT
NetIC5_12: U1.43(PE7_(SYNC,_TXD1,_SCK,_TOSC1,_CLKPER,_EVOUT)) ; port IMU_SCK
NetIC5_13: U1.42(PE6_(SYNC,_RXD1,_MISO,_TOSC2)) ; port IMU_MISO
NetIC5_14: U1.41(PE5_(SYNC,_OC1B,_XCK1,_MOSI)) ; port IMU_MOSI
NetIC5_16: U1.40(PE4_(SYNC,_OC1A,_SS)) ; port IMU_SS
NetIC8_1: IC8.1(SS) U1.20(PC4_(SYNC,_0C1A,_SS))
NetIC8_2: IC8.2(MISO) U1.22(PC6_(SYNC,_RXD1,_MISO,_RTCOUT))
NetIC8_5: IC8.5(MOSI) U1.21(PC5_(SYNC,_0C1B,_XCK1,_MOSI))
NetIC8_6: IC8.6(CLK) U1.23(PC7_(SYNC,_TXD1,_SCK,_CLKPER,_EVOUT))
NetLED1_C: LED1.C R7.2
NetLED2_C: LED2.C R8.2
NetLED3_C: LED3.C R10.2
NetR1_2: U1.38(PE2_(SYNC/ASYNC,_OC0C,_RXD0,_SDAOUT)) ; port DebugUart_RX
NetR2_2: U1.39(PE3_(SYNC,_OC0D,_TXD0,_SCLOUT)) ; port DebugUart_TX
NetR3_2: U1.48(PF2_(SYNC/ASYNC,_OC0C,_RXD0)) ; port ExtUart_RX
NetR4_2: U1.49(PF3_(SYNC,_OC0D,_TXD0)) ; port ExtUart_TX
NetR18_2: U1.29(PD3_(SYNC,_OC0D,_TXD0)) ; port GPS_TX
NetR19_2: U1.28(PD2_(SYNC/ASYNC,_OC0C,_RXD0)) ; port GPS_RX

Not connected (* = marked no-connect by the designer): U1 4(PA6_(SYNC,_ADC6,_AC6,_AC1OUT)) 5(PA7_(SYNC,_ADC7,_AC7,_AC0OUT)) 6(PB0_(SYNC,_ADC8,_AC0,_AREF)) 7(PB1_(SYNC,_ADC9,_AC1)) 8(PB2_(SYNC/ASYNC,_ADC10,_AC2,_DAC0)) 9(PB3_(SYNC,_ADC11,_AC3,_DAC1)) 10(PB4_(SYNC,_ADC12,_AC4,_TMS)) 11(PB5_(SYNC,_ADC13,_AC5,_TDI)) 12(PB6_(SYNC,_ADC14,_AC6,_AC1OUT,_TCK)) 47(PF1_(SYNC,_OC0B,_XCK0)) 50(PF4_(SYNC)) 51(PF5_(SYNC)) 54(PF6_(SYNC)) 55(PF7_(SYNC)) 62(PA0_(SYNC,_ADC0,_AC0,_AREF))

### Notes on the sheet
- (in symbol TitleBox) Document:; Project:; Drawn By:; Revision:; Date:; Sheet; Of

### Library data of the parts
C1-C6 C22 C24 C40 C43 C49 = Capacitor: as C7 on sheet Power; Characteristic: *; Manufacturer: *; Note: C0603 N
D5 D6 D17 = ESD9L3.3ST5G: as D1 on sheet Uarts; Supplier 1: Farnell; Manufacturer: ON Semiconductor; Manufacturer Part Number: ESD9L3.3ST5G; Case/Package: SOD-923-2; Operating Temperature Range: -55 .. 125°C; Peak Pulse Power: 150mW; ComponentLink1URL: https://www.verical.com/server-webapp/html/getDatasheet?partID=148186&src-supplier=Verical; ComponentLink1Description: Datasheet; Supplier Part Number 1: 2533269
IC8 = M95M02-DWMN3TP/K: EEPROM, 2.5...5Vin, 2Mbit, 256Kx8Bit, SPI, 5...10MHz; ComponentLink1Description: Datasheet; ComponentLink1URL: http://www.farnell.com/datasheets/2374181.pdf?_ga=2.101041480.87678497.1585049483-1429076973.1585049483
J3 = AVR PDI header 2x3 male: Male header 2x3, PDI
LED1-LED3 = Generic LED: SMD mono-color Chip LED; Color: Green
R5-R8 R10-R12 R29 R30 = Resistor: as R25 on sheet Power; Manufacturer: *; Note: R0603
  R5 R6: Resistance: 4.7K
  R7 R8 R10: Resistance: 1.2K
  R11 R12: Resistance: 1K
  R29: Resistance: 110K
  R30: Resistance: 100K
U1 = ATXMEGA256A3U: MCU, 8-bit, 256KB flash, 50 I/Os, ATXMEGA2563U, 64-TQFP, Microchip; Supplier 1: Farnell; ComponentLink1Description: Datasheet; ComponentLink1URL: http://ww1.microchip.com/downloads/en/devicedoc/atmel-8386-8-and-16-bit-avr-microcontroller-atxmega64a3u-128a3u-192a3u-256a3u_datasheet.pdf; Supplier Part Number 1: 2066307
XTAL1 = 7M-16.000MAAJ-T: Manufacturer: TXC; Frequency: 16MHz; Frequency Tolerance: 30ppm; Load Capacitance: 18pF; ESR (Equivalent Series Resistance): 100R; Supplier 1: Farnell; Supplier Part Number 1: 1842060; Manufacturer Part Number: 7M-16.000MAAJ-T; Pricing 1: 1=1.09, 50=0.726, 100=0.642, 250=0.625, 500=0.608, 1000=0.516, 5000=0.506 (EUR); Case/Package: SMD/SMT; Operating Temperature Range: -10°C .. 70°C; Tolerance: 30ppm; Frequency Stability: 30ppm; Length: 3.2mm; Height: 0.031inch; Dimensions: 3.2mm*2.5mm; ComponentLink1URL: https://datasheet.ciiva.com/1356/number-crystal-basic-1356577.pdf; ComponentLink1Description: Datasheet; ComponentLink3URL: https://datasheet.ciiva.com/855/7m-855384.pdf; ComponentLink3Description: Datasheet; Supplier 2: Mouser; Supplier Part Number 2: 717-7M-16.000MAAJ-T

## Sheet Motors.SchDoc
size A4; SheetNumber: 5; SheetTotal: 8
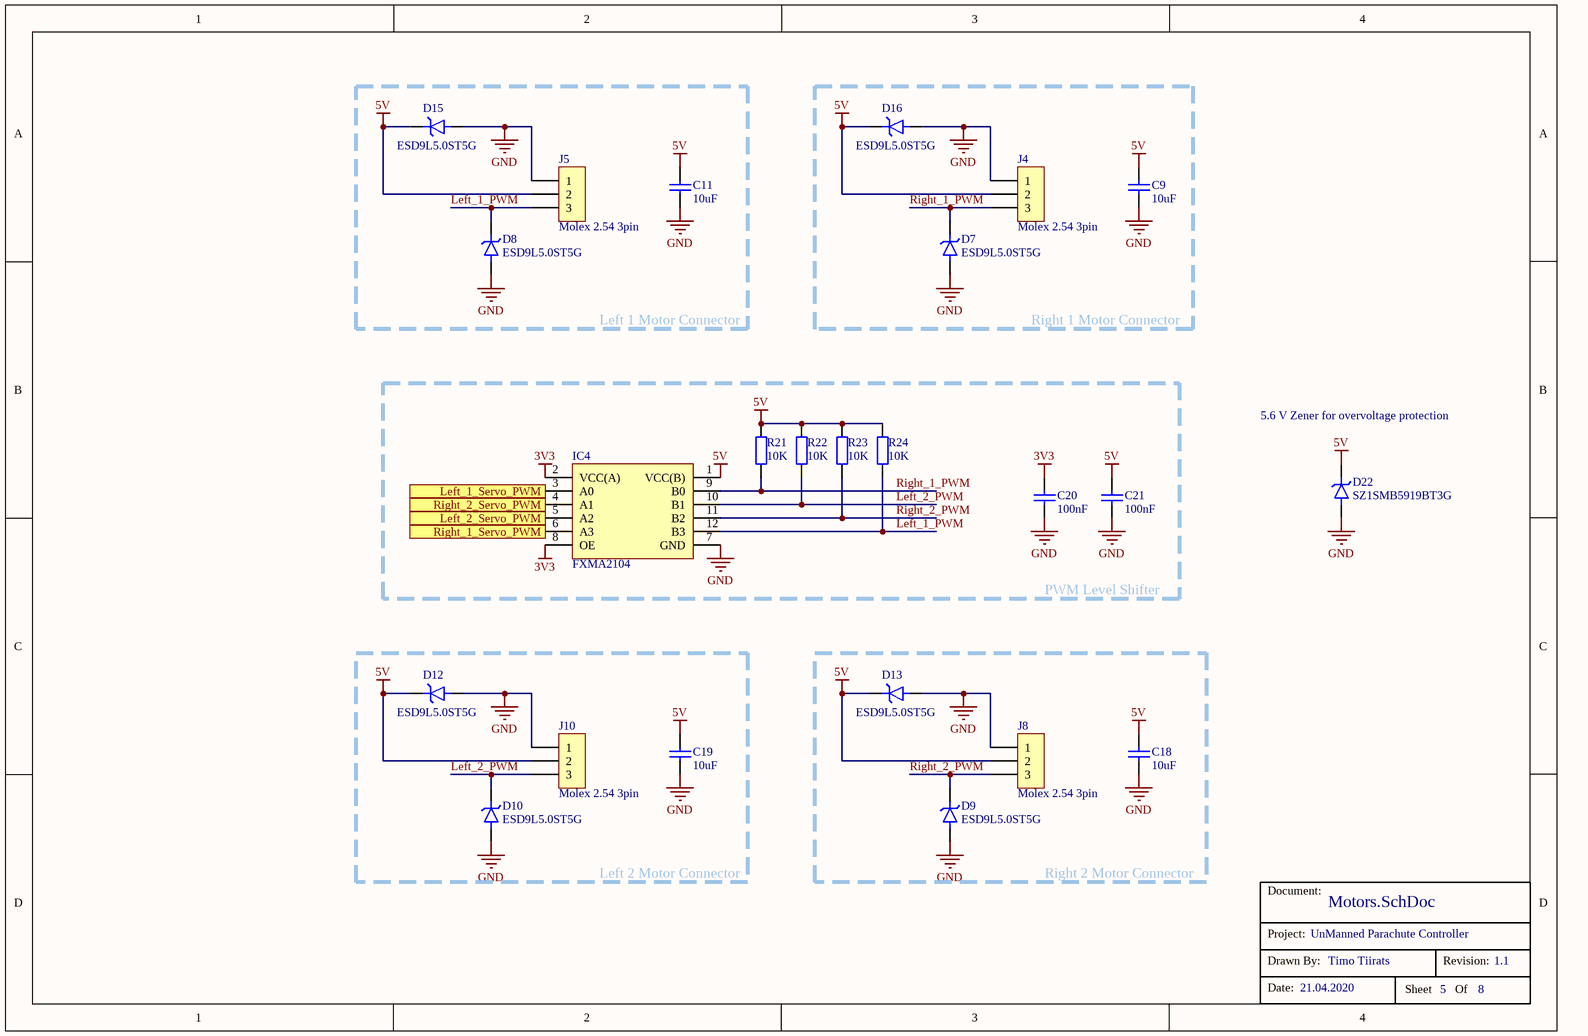
[diagram p6: Motors.SchDoc]

### Parts
(Parts that share a designator on the sheet are numbered #1, #2 ... from top to bottom, then left to right.)
*#7  TitleBox  (value not drawn)
C9  Capacitance: 10uF  [C1206 N]
C11  Capacitance: 10uF  [C1206 N]
C18  Capacitance: 10uF  [C1206 N]
C19  Capacitance: 10uF  [C1206 N]
C20  Capacitance: 100nF  [C0603 N]
C21  Capacitance: 100nF  [C0603 N]
D7  ESD9L5.0ST5G  [SOD923F, NOMINAL]
D8  ESD9L5.0ST5G  [SOD923F, NOMINAL]
D9  ESD9L5.0ST5G  [SOD923F, NOMINAL]
D10  ESD9L5.0ST5G  [SOD923F, NOMINAL]
D12  ESD9L5.0ST5G  [SOD923F, NOMINAL]
D13  ESD9L5.0ST5G  [SOD923F, NOMINAL]
D15  ESD9L5.0ST5G  [SOD923F, NOMINAL]
D16  ESD9L5.0ST5G  [SOD923F, NOMINAL]
D22  SZ1SMB5919BT3G  [DO-214, NOMINAL]
IC4  FXMA2104  [QFN12 1.8x1.8, NOMINAL]
J4  Molex 2.54 3pin  [22-27-2031]
J5  Molex 2.54 3pin  [22-27-2031]
J8  Molex 2.54 3pin  [22-27-2031]
J10  Molex 2.54 3pin  [22-27-2031]
R21  10K  [R0603]
R22  10K  [R0603]
R23  10K  [R0603]
R24  10K  [R0603]

### Blocks framed on the sheet
Left 1 Motor Connector: C11 D8 D15 J5
Right 1 Motor Connector: C9 D7 D16 J4
PWM Level Shifter: C20 C21 IC4 R21-R24
Left 2 Motor Connector: C19 D10 D12 J10
Right 2 Motor Connector: C18 D9 D13 J8

### Ports
Left_1_Servo_PWM (in), Left_2_Servo_PWM (in), Right_1_Servo_PWM (in), Right_2_Servo_PWM (in)

### Nets
3V3: C20.2 IC4.2(VCC(A)) IC4.8(OE)
5V: C9.2 C11.2 C18.2 C19.2 C21.2 D12.C D13.C D15.C D16.C D22.C IC4.1(VCC(B)) J4.2 J5.2 J8.2 J10.2 R21.2 R22.2 R23.2 R24.2
GND: C9.1 C11.1 C18.1 C19.1 C20.1 C21.1 D7.A D8.A D9.A D10.A D12.A D13.A D15.A D16.A D22.A IC4.7(GND) J4.1 J5.1 J8.1 J10.1
Left_1_PWM: D8.C IC4.12(B3) J5.3 R24.1
Left_2_PWM: D10.C IC4.10(B1) J10.3 R22.1
Right_1_PWM: D7.C IC4.9(B0) J4.3 R21.1
Right_2_PWM: D9.C IC4.11(B2) J8.3 R23.1
NetIC4_3: IC4.3(A0) ; port Left_1_Servo_PWM
NetIC4_4: IC4.4(A1) ; port Right_2_Servo_PWM
NetIC4_5: IC4.5(A2) ; port Left_2_Servo_PWM
NetIC4_6: IC4.6(A3) ; port Right_1_Servo_PWM

### Notes on the sheet
- 5.6 V Zener for overvoltage protection
- (in symbol TitleBox) Document:; Project:; Drawn By:; Revision:; Date:; Sheet; Of

### Library data of the parts
C9 C11 C18 C19 = Capacitor: Ceramic capacitor; Type: MLCC; Voltage rating: 25V; Characteristic: X7R; Manufacturer: *; Note: C1206 N
C20 C21 = Capacitor: as C7 on sheet Power; Characteristic: *; Manufacturer: *; Note: C0603 N
D7-D10 D12 D13 D15 D16 = ESD9L5.0ST5G: TVS DIODE, Unidir, 5V/9.8V, 150mW, SOD-923, ESD9L5.0ST5G, ON SEMICONDUCTOR; Clamping Voltage: 9.8V; Reverse Standoff Voltage: 5V; Leakage Current: 1uA; Peak Pulse Current: 1A; Breakdown Voltage: 5.4 .. 5.8V; Supplier 1: Farnell; Manufacturer: ON Semiconductor; Manufacturer Part Number: ESD9L5.0ST5G; Operating Temperature Range: -55 .. 150°C; Operating Supply Voltage: 5V; Max Surge Current: 1A; Peak Pulse Power: 150mW; ComponentLink1URL: http://www.mouser.com/ds/2/308/ESD9L-D-278322.pdf?src-supplier=Mouser; ComponentLink1Description: Datasheet; Supplier 2: TME; Supplier Part Number 1: 1651639RL; Supplier Part Number 2: ESD9L5.0ST5G
D22 = SZ1SMB5918BT3G: ZENER, 5.1V, 3W, SOD-123, ON SEMICONDUCTOR, SZ1SMB5918BT3G; ComponentLink1Description: Datasheet; ComponentLink1URL: http://www.farnell.com/datasheets/2160707.pdf?_ga=2.214989202.465896120.1585759027-1429076973.1585049483
IC4 = FXMA2104: Level shifter, 4 inputs, 1.65 .. 5.5Vin, 3ns delay, FXMA2104, ON SEMICONDUCTOR; Supplier 1: Farnell; Supplier Part Number 1: 2822577; ComponentLink1Description: Datasheet; ComponentLink1URL: http://www.farnell.com/datasheets/2552660.pdf?_ga=2.61529188.991561592.1575804886-1961576694.1568451101
J4 J5 J8 J10 = Molex header, 3 pin, KK 6410 series: Current Rating: 4A; Supplier 1: Farnell; Manufacturer Part Number: 22-27-2031; Product Range: KK 6410 Series; ComponentLink1URL: http://www.farnell.com/datasheets/1023435.pdf; ComponentLink1Description: Datasheet; ComponentLink2URL: http://www.farnell.com/cad/1595526.pdf; ComponentLink2Description: Drawing; Supplier 2: Mouser; Supplier 3: TME; Supplier Part Number 1: 9731156; Supplier Part Number 2: 538-22-27-2031; Supplier Part Number 3: MX-6410-03A
R21-R24 = Resistor: as R25 on sheet Power; Manufacturer: *; Resistance: 10K; Note: R0603

## Sheet Barometers.SchDoc
size A4; SheetNumber: 8; SheetTotal: 8
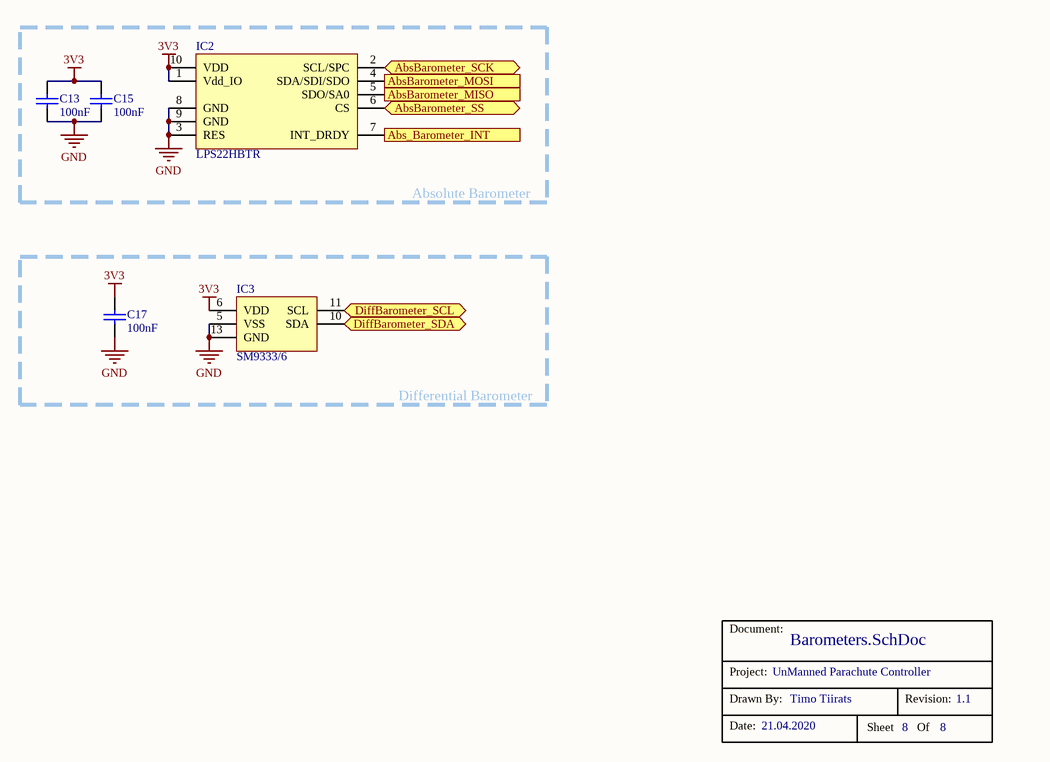
[diagram p7: Barometers.SchDoc]

### Parts
(Parts that share a designator on the sheet are numbered #1, #2 ... from top to bottom, then left to right.)
*#8  TitleBox  (value not drawn)
C13  Capacitance: 100nF  [C0603 N]
C15  Capacitance: 100nF  [C0603 N]
C17  Capacitance: 100nF  [C0603 N]
IC2  LPS22HBTR  [HLGA-10L, Least]
IC3  SM9333/6  [SOIC16, LEAST]

### Blocks framed on the sheet
Absolute Barometer: C13 C15 IC2
Differential Barometer: C17 IC3

### Ports
Abs_Barometer_INT (out), AbsBarometer_MISO (out), AbsBarometer_MOSI (in), AbsBarometer_SCK (bidir), AbsBarometer_SS (bidir), DiffBarometer_SCL (bidir), DiffBarometer_SDA (bidir)

### Nets
3V3: C13.2 C15.2 C17.2 IC2.1(Vdd_IO) IC2.10(VDD) IC3.6(VDD)
GND: C13.1 C15.1 C17.1 IC2.3(RES) IC2.8(GND) IC2.9(GND) IC3.5(VSS) IC3.13(GND)
NetIC2_2: IC2.2(SCL/SPC) ; port AbsBarometer_SCK
NetIC2_4: IC2.4(SDA/SDI/SDO) ; port AbsBarometer_MOSI
NetIC2_5: IC2.5(SDO/SA0) ; port AbsBarometer_MISO
NetIC2_6: IC2.6(CS) ; port AbsBarometer_SS
NetIC2_7: IC2.7(INT_DRDY) ; port Abs_Barometer_INT
NetIC3_10: IC3.10(SDA) ; port DiffBarometer_SDA
NetIC3_11: IC3.11(SCL) ; port DiffBarometer_SCL

### Notes on the sheet
- (in symbol TitleBox) Document:; Project:; Drawn By:; Revision:; Date:; Sheet; Of

### Library data of the parts
C13 C15 C17 = Capacitor: as C7 on sheet Power; Characteristic: *; Manufacturer: *; Note: C0603 N
IC2 = LPS22HBTR: Pressure Sensor, 260-1260 hPa, 1Hz...75Hz, 1.7...3.6Vin, 12uA, 24-bit, LPS22HBTR, HLGA-10L, STMicroelectronics; ComponentLink1Description: Datasheet; ComponentLink1URL: https://www.st.com/resource/en/datasheet/lps22hb.pdf; Supplier 1: Farnell; Supplier Part Number 1: 2532382
IC3 = SM9333/6: Differentsial sensor, 125 or 250 Pa, 2000Hz, 3.0-5.5Vin; ComponentLink1Description: Datasheet; ComponentLink1URL: https://www.mouser.com/datasheet/2/589/Datasheet_SM9333_SM9336-1317493.pdf

## Nets that join several sheets
1V8: Power (C28.2 C29.2 LDO1.5), IMUAndSonar (7 pins)
3V3: Power (8 pins), Uarts (C35.2 D20.C J1.1), GPS (C39.2 D21.C IC6.1), IMUAndSonar (5 pins), MCU (18 pins), Motors (C20.2 IC4.2 IC4.8), Barometers (6 pins)
5V: Power (5 pins), Motors (19 pins)
GND: Power (39 pins), Uarts (8 pins), GPS (5 pins), IMUAndSonar (14 pins), MCU (28 pins), Motors (20 pins), Barometers (8 pins)
Vbat: Power (14 pins), MCU (R29.1)
NetC22_2: IMUAndSonar (R14.1 R20.2), MCU (C22.2 U1.63)
NetIC2_2: MCU (U1.33), Barometers (IC2.2)
NetIC2_4: MCU (U1.31), Barometers (IC2.4)
NetIC2_5: MCU (U1.32), Barometers (IC2.5)
NetIC2_6: MCU (U1.30), Barometers (IC2.6)
NetIC2_7: MCU (U1.26), Barometers (IC2.7)
NetIC3_10: MCU (R5.1 U1.36), Barometers (IC3.10)
NetIC3_11: MCU (R6.1 U1.37), Barometers (IC3.11)
NetIC4_3: MCU (U1.19), Motors (IC4.3)
NetIC4_4: MCU (U1.18), Motors (IC4.4)
NetIC4_5: MCU (U1.17), Motors (IC4.5)
NetIC4_6: MCU (U1.16), Motors (IC4.6)
NetIC5_11: IMUAndSonar (IC5.11), MCU (U1.46)
NetIC5_12: IMUAndSonar (IC5.12), MCU (U1.43)
NetIC5_13: IMUAndSonar (IC5.13), MCU (U1.42)
NetIC5_14: IMUAndSonar (IC5.14), MCU (U1.41)
NetIC5_16: IMUAndSonar (IC5.16), MCU (U1.40)
NetR1_2: Uarts (R1.2), MCU (U1.38)
NetR2_2: Uarts (R2.2), MCU (U1.39)
NetR3_2: Uarts (R3.2), MCU (U1.48)
NetR4_2: Uarts (R4.2), MCU (U1.49)
NetR18_2: GPS (R18.2), MCU (U1.29)
NetR19_2: GPS (R19.2), MCU (U1.28)